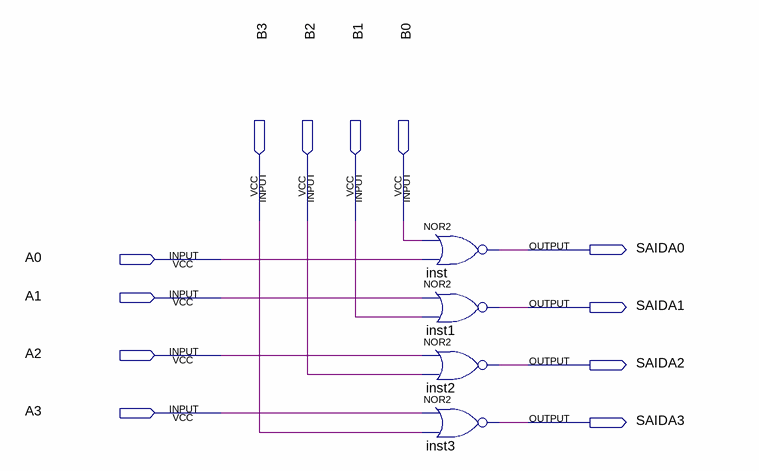
[diagram p0: schematic sheet]
// Quartus schematic nao_ou.bdf as structural Verilog: 4 symbols, 12 pins
module nao_ou (
  input  B3,
  input  B2,
  input  B1,
  input  B0,
  input  A0,
  input  A1,
  input  A2,
  input  A3,
  output SAIDA0,
  output SAIDA1,
  output SAIDA2,
  output SAIDA3
);

  nor inst (SAIDA0, B0, A0);
  nor inst1 (SAIDA1, A1, B1);
  nor inst2 (SAIDA2, A2, B2);
  nor inst3 (SAIDA3, A3, B3);
endmodule
